# EAGLE schematic PlayaRAMPS1.4 (EAGLE 9.3.1)
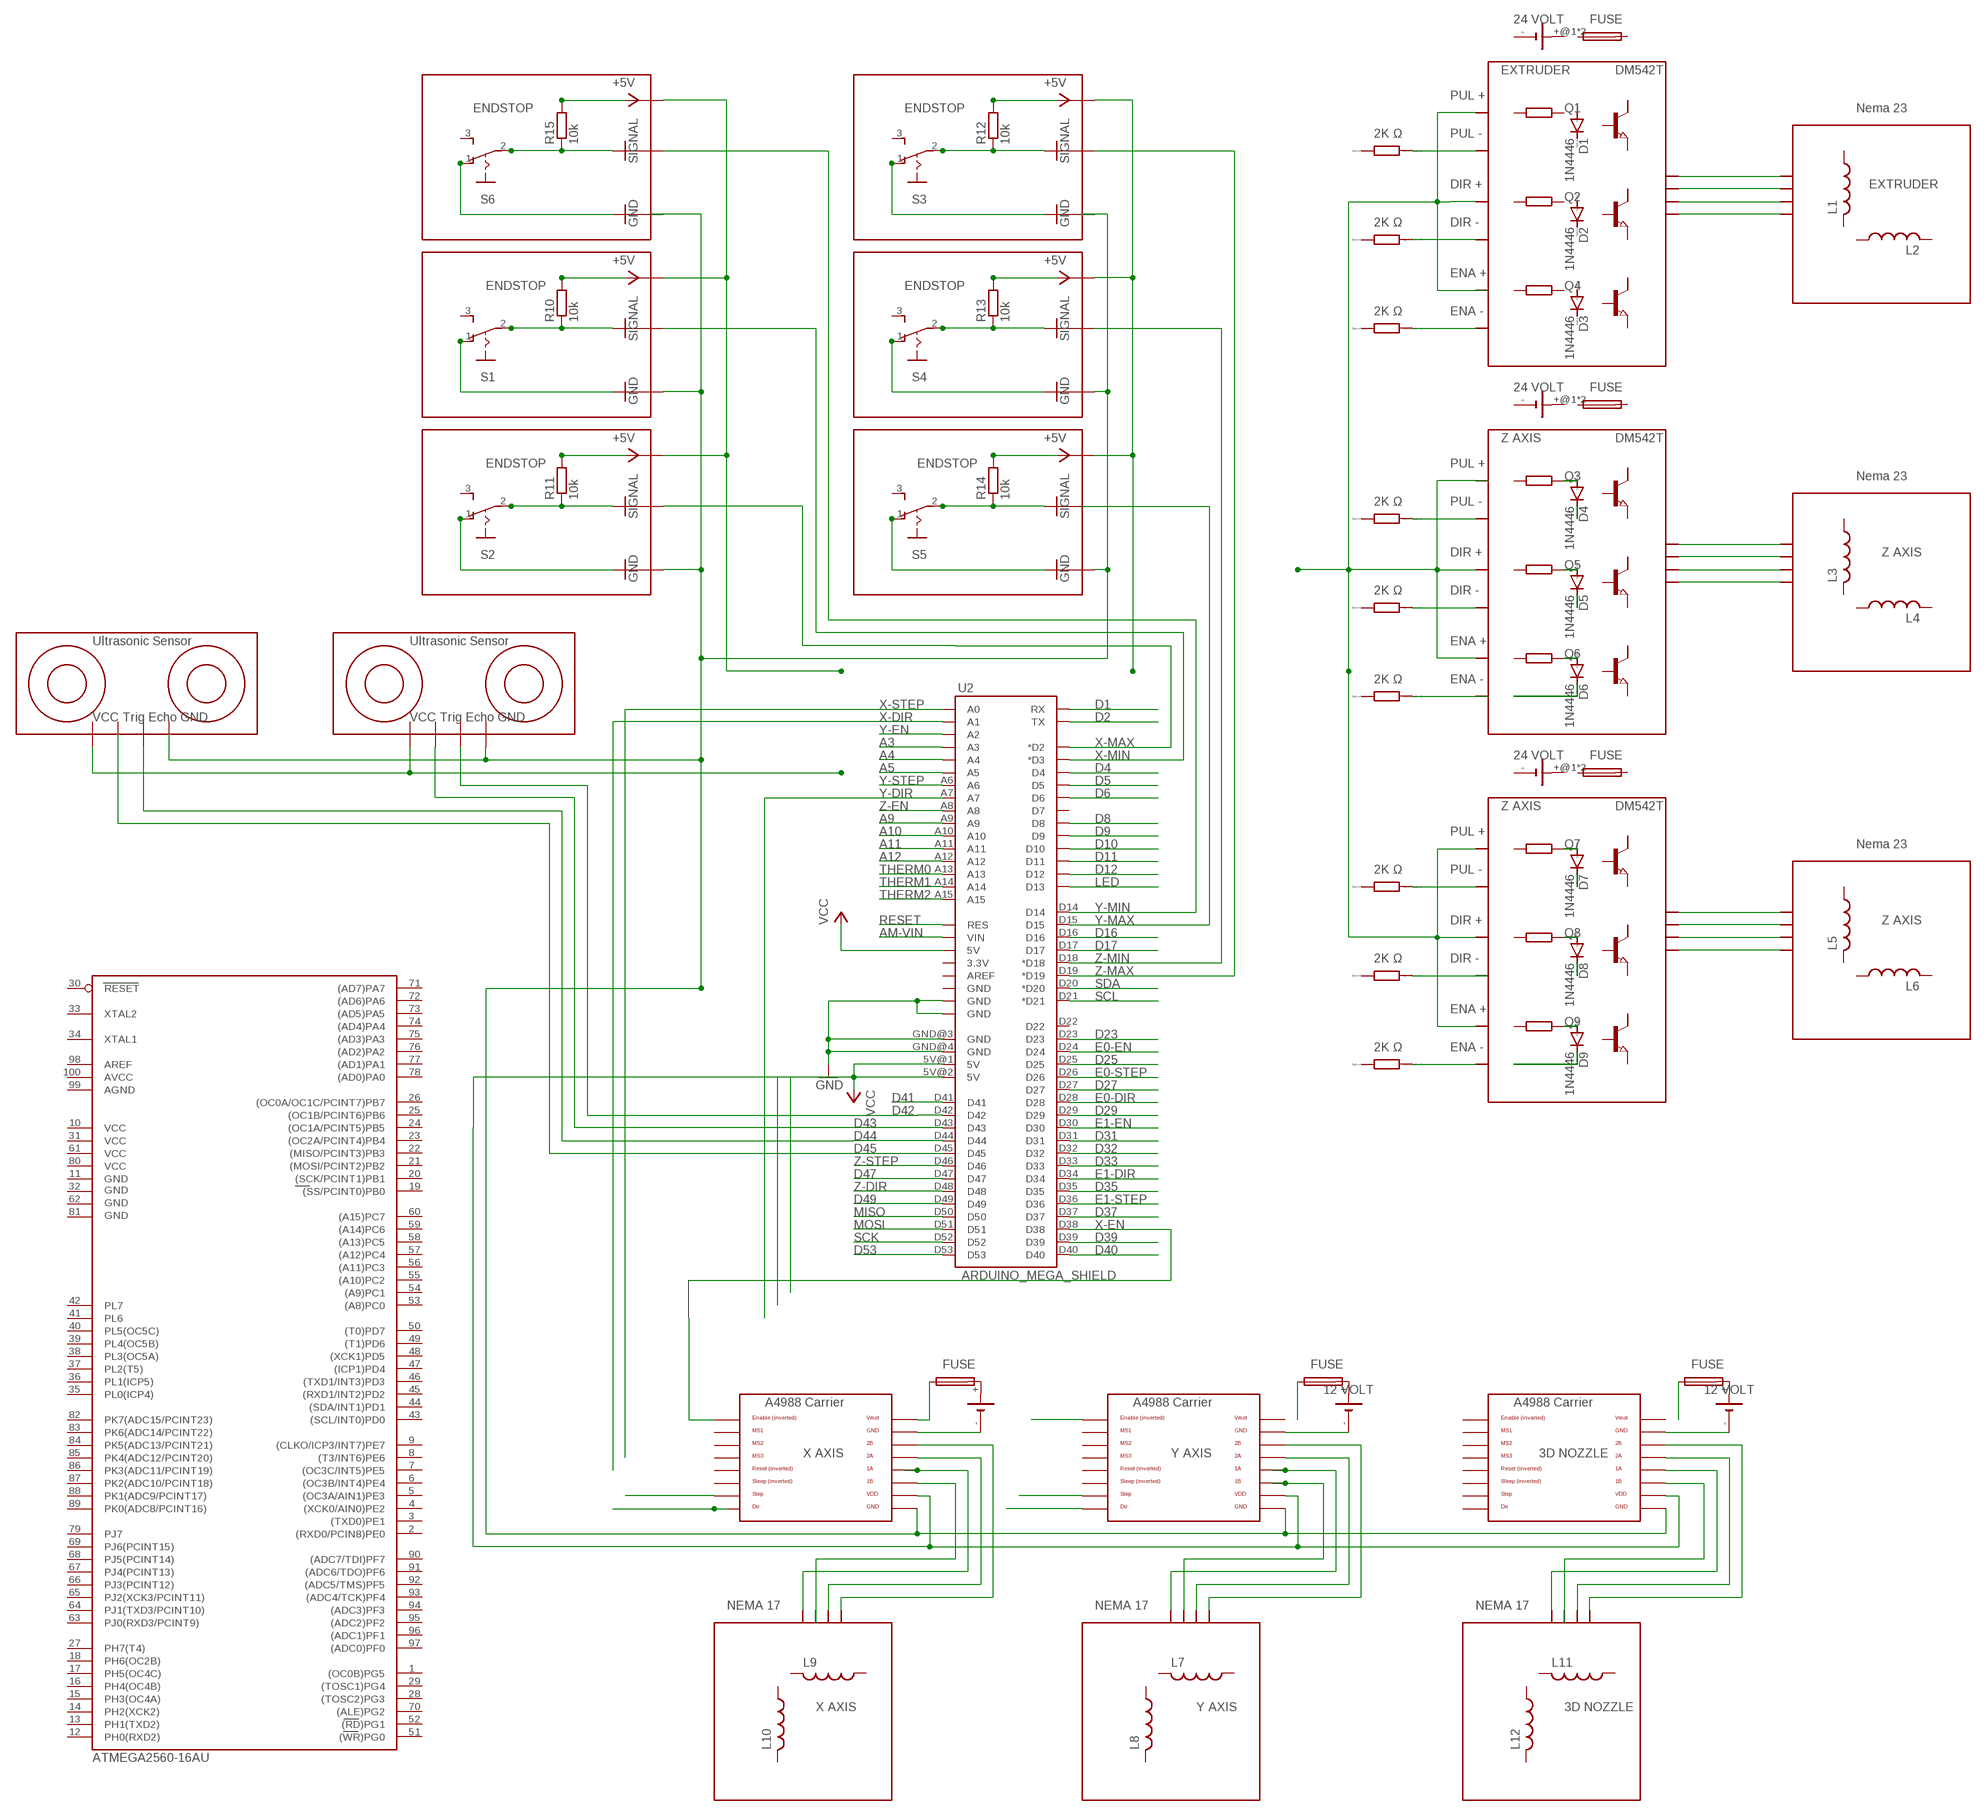
[diagram p0: schematic, sheet 1, part 1 of 2]
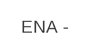
[diagram p1: schematic, sheet 1, part 2 of 2]

## Parts
D1  1N4446  [DO35-10]
D2  1N4446  [DO35-10]
D3  1N4446  [DO35-10]
D4  1N4446  [DO35-10]
D5  1N4446  [DO35-10]
D6  1N4446  [DO35-10]
D7  1N4446  [DO35-10]
D8  1N4446  [DO35-10]
D9  1N4446  [DO35-10]
F1  QPL  [QPL]
F2  QPL  [QPL]
F3  QPL  [QPL]
F4  QPL  [QPL]
F5  QPL  [QPL]
F6  QPL  [QPL]
G1  10MM_SM_COIN_CELL_CLIP  [10MM_SM_COIN_CELL_CLIP]
G2  CH291-1220LF  [CH291-1220LF]
G3  CH291-1220LF  [CH291-1220LF]
G4  CH291-1220LF  [CH291-1220LF]
G5  10MM_SM_COIN_CELL_CLIP  [10MM_SM_COIN_CELL_CLIP]
G6  10MM_SM_COIN_CELL_CLIP  [10MM_SM_COIN_CELL_CLIP]
IC3  ATMEGA2560-16AU  ATMEGA25602560-16AU  [TQFP100]
L1  L-US0204/5  [0204/5]
L2  L-US0204/5  [0204/5]
L3  L-US0204/5  [0204/5]
L4  L-US0204/5  [0204/5]
L5  L-US0204/5  [0204/5]
L6  L-US0204/5  [0204/5]
L7  L-US0204/5  [0204/5]
L8  L-US0204/5  [0204/5]
L9  L-US0204/5  [0204/5]
L10  L-US0204/5  [0204/5]
L11  L-US0204/5  [0204/5]
L12  L-US0204/5  [0204/5]
Q1  NPN-TRANSISTIOR-2COLSOT143  [SOT143]
Q2  NPN-TRANSISTIOR-2COLSOT143  [SOT143]
Q3  NPN-TRANSISTIOR-2COLSOT143  [SOT143]
Q4  NPN-TRANSISTIOR-2COLSOT143  [SOT143]
Q5  NPN-TRANSISTIOR-2COLSOT143  [SOT143]
Q6  NPN-TRANSISTIOR-2COLSOT143  [SOT143]
Q7  NPN-TRANSISTIOR-2COLSOT143  [SOT143]
Q8  NPN-TRANSISTIOR-2COLSOT143  [SOT143]
Q9  NPN-TRANSISTIOR-2COLSOT143  [SOT143]
R10  10k  R-EU_0204/7  [0204/7]
R11  10k  R-EU_0204/7  [0204/7]
R12  10k  R-EU_0204/7  [0204/7]
R13  10k  R-EU_0204/7  [0204/7]
R14  10k  R-EU_0204/7  [0204/7]
R15  10k  R-EU_0204/7  [0204/7]
R16  R  [R0805]
R17  R  [R0805]
R18  R  [R0805]
R19  R  [R0805]
R20  R  [R0805]
R21  R  [R0805]
R22  R  [R0805]
R23  R  [R0805]
R24  R  [R0805]
S1  255SB  [255SB]
S2  255SB  [255SB]
S3  255SB  [255SB]
S4  255SB  [255SB]
S5  255SB  [255SB]
S6  255SB  [255SB]
U2  ARDUINO_MEGA_SHIELD  [ARDUINO_MEGA_SHIELD]
X1  A4988BREAKOUT  [A4988BREAKOUT]
X2  A4988BREAKOUT  [A4988BREAKOUT]
X3  A4988BREAKOUT  [A4988BREAKOUT]

## Nets
+5V: R10.2 R11.2 R12.2 R13.2 R14.2 R15.2
A3: U2.A3
A4: U2.A4
A5: U2.A5
A9: U2.A9
A10: U2.A10
A11: U2.A11
A12: U2.A12
AM-VIN: U2.VIN
D1: U2.RX
D2: U2.TX
D4: U2.D4
D5: U2.D5
D6: U2.D6
D8: U2.D8
D9: U2.D9
D10: U2.D10
D11: U2.D11
D12: U2.D12
D16: U2.D16
D17: U2.D17
D23: U2.D23
D25: U2.D25
D27: U2.D27
D29: U2.D29
D31: U2.D31
D32: U2.D32
D33: U2.D33
D35: U2.D35
D37: U2.D37
D39: U2.D39
D40: U2.D40
D41: U2.D41
D42: U2.D42
D43: U2.D43
D44: U2.D44
D45: U2.D45
D47: U2.D47
D49: U2.D49
D53: U2.D53
E0-DIR: U2.D28
E0-EN: U2.D24
E0-STEP: U2.D26
E1-DIR: U2.D34
E1-EN: U2.D30
E1-STEP: U2.D36
GND: R10.1 R11.1 R12.1 R13.1 R14.1 R15.1 S1.1(O) S1.2(P) S2.1(O) S2.2(P) S3.1(O) S3.2(P) S4.1(O) S4.2(P) S5.1(O) S5.2(P) S6.1(O) S6.2(P) U2.GND@0(GND) U2.GND@1(GND) U2.GND@3(GND) U2.GND@4(GND) ; supply symbol labelled SIGNAL
LED: U2.D13
MISO: U2.D50
MOSI: U2.D51
N$1: D4.A
N$2: R16.2
N$3: R17.2
N$4: X2.STEP
N$5: R18.2
N$6: D5.A
N$7: D6.A
N$8: D6.C
N$9: D5.C
N$10: D4.C
N$15: D7.A
N$16: D8.A
N$17: D9.A
N$18: D9.C
N$19: D8.C
N$20: X2.EN
N$31: F1.2 G2.+
N$32: F2.2 G3.+
N$33: F3.2 G4.+
N$34: X3.1A
N$35: X3.1B
N$37: X3.2A
N$38: X3.2B
N$39: X2.2A
N$40: X1.1B
N$41: X1.1A
N$42: X1.2A
N$43: X1.2B
N$49: D7.C
N$54: R19.2
N$55: R20.2
N$56: R21.2
N$59: R22.2
N$60: R23.2
N$61: R24.2
N$62: X2.1B
N$63: X2.1A
N$64: X2.2B
N$65: G4.- X3.GND
N$66: F3.1
N$67: F2.1
N$68: G3.- X2.GND
N$69: G2.- X1.GND
N$70: F1.1 X1.VMOT
N$72: X1.GND@0(GND) X2.GND@0(GND) X3.GND@0(GND)
RESET: U2.RES
SCK: U2.D52
SCL: U2.D21(*D21)
SDA: U2.D20(*D20)
THERM0: U2.A13
THERM1: U2.A14
THERM2: U2.A15
VCC: U2.5V@0(5V) U2.5V@1(5V) U2.5V@2(5V) X1.VDD X2.VDD X3.VDD
X-DIR: U2.A1
X-DIR1: X1.DIR
X-EN: U2.D38
X-EN1: X1.EN
X-MAX: U2.D2(*D2)
X-MIN: U2.D3(*D3)
X-STEP: U2.A0
X-STEP1: X1.STEP
Y-DIR: U2.A7
Y-DIR1: X2.DIR
Y-EN: U2.A2
Y-MAX: U2.D15
Y-MIN: U2.D14
Y-STEP: U2.A6
Z-DIR: U2.D48
Z-EN: U2.A8
Z-MAX: U2.D19(*D19)
Z-MIN: U2.D18(*D18)
Z-STEP: U2.D46
Unconnected: D1.A D1.C D2.A D2.C D3.A D3.C F4.1 F4.2 F5.1 F5.2 F6.1 F6.2 G1.+@1(+) G1.+@2(+) G1.- G5.+@1(+) G5.+@2(+) G5.- G6.+@1(+) G6.+@2(+) G6.- IC3.1((OC0B)PG5) IC3.2((RXD0/PCIN8)PE0) IC3.3((TXD0)PE1) IC3.4((XCK0/AIN0)PE2) IC3.5((OC3A/AIN1)PE3) IC3.6((OC3B/INT4)PE4) IC3.7((OC3C/INT5)PE5) IC3.8((T3/INT6)PE6) IC3.9((CLKO/ICP3/INT7)PE7) IC3.12(PH0(RXD2)) IC3.13(PH1(TXD2)) IC3.14(PH2(XCK2)) IC3.15(PH3(OC4A)) IC3.16(PH4(OC4B)) IC3.17(PH5(OC4C)) IC3.18(PH6(OC2B)) IC3.19((SS/PCINT0)PB0) IC3.20((SCK/PCINT1)PB1) IC3.21((MOSI/PCINT2)PB2) IC3.22((MISO/PCINT3)PB3) IC3.23((OC2A/PCINT4)PB4) IC3.24((OC1A/PCINT5)PB5) IC3.25((OC1B/PCINT6)PB6) IC3.26((OC0A/OC1C/PCINT7)PB7) IC3.27(PH7(T4)) IC3.28((TOSC2)PG3) IC3.29((TOSC1)PG4) IC3.30(RESET) IC3.33(XTAL2) IC3.34(XTAL1) IC3.35(PL0(ICP4)) IC3.36(PL1(ICP5)) IC3.37(PL2(T5)) IC3.38(PL3(OC5A)) IC3.39(PL4(OC5B)) IC3.40(PL5(OC5C)) IC3.41(PL6) IC3.42(PL7) IC3.43((SCL/INT0)PD0) IC3.44((SDA/INT1)PD1) IC3.45((RXD1/INT2)PD2) IC3.46((TXD1/INT3)PD3) IC3.47((ICP1)PD4) IC3.48((XCK1)PD5) IC3.49((T1)PD6) IC3.50((T0)PD7) IC3.51((WR)PG0) IC3.52((RD)PG1) IC3.53((A8)PC0) IC3.54((A9)PC1) IC3.55((A10)PC2) IC3.56((A11)PC3) IC3.57((A12)PC4) IC3.58((A13)PC5) IC3.59((A14)PC6) IC3.60((A15)PC7) IC3.63(PJ0(RXD3/PCINT9)) IC3.64(PJ1(TXD3/PCINT10)) IC3.65(PJ2(XCK3/PCINT11)) IC3.66(PJ3(PCINT12)) IC3.67(PJ4(PCINT13)) IC3.68(PJ5(PCINT14)) IC3.69(PJ6(PCINT15)) IC3.70((ALE)PG2) IC3.71((AD7)PA7) IC3.72((AD6)PA6) IC3.73((AD5)PA5) IC3.74((AD4)PA4) IC3.75((AD3)PA3) IC3.76((AD2)PA2) IC3.77((AD1)PA1) IC3.78((AD0)PA0) IC3.79(PJ7) IC3.82(PK7(ADC15/PCINT23)) IC3.83(PK6(ADC14/PCINT22)) IC3.84(PK5(ADC13/PCINT21)) IC3.85(PK4(ADC12/PCINT20)) IC3.86(PK3(ADC11/PCINT19)) IC3.87(PK2(ADC10/PCINT18)) IC3.88(PK1(ADC9/PCINT17)) IC3.89(PK0(ADC8/PCINT16)) IC3.90((ADC7/TDI)PF7) IC3.91((ADC6/TDO)PF6) IC3.92((ADC5/TMS)PF5) IC3.93((ADC4/TCK)PF4) IC3.94((ADC3)PF3) IC3.95((ADC2)PF2) IC3.96((ADC1)PF1) IC3.97((ADC0)PF0) IC3.98(AREF) L1.1 L1.2 L2.1 L2.2 L3.1 L3.2 L4.1 L4.2 L5.1 L5.2 L6.1 L6.2 L7.1 L7.2 L8.1 L8.2 L9.1 L9.2 L10.1 L10.2 L11.1 L11.2 L12.1 L12.2 Q1.1(B) Q1.2(C) Q1.3(E) Q1.4(C/) Q2.1(B) Q2.2(C) Q2.3(E) Q2.4(C/) Q3.1(B) Q3.2(C) Q3.3(E) Q3.4(C/) Q4.1(B) Q4.2(C) Q4.3(E) Q4.4(C/) Q5.1(B) Q5.2(C) Q5.3(E) Q5.4(C/) Q6.1(B) Q6.2(C) Q6.3(E) Q6.4(C/) Q7.1(B) Q7.2(C) Q7.3(E) Q7.4(C/) Q8.1(B) Q8.2(C) Q8.3(E) Q8.4(C/) Q9.1(B) Q9.2(C) Q9.3(E) Q9.4(C/) R16.1 R17.1 R18.1 R19.1 R20.1 R21.1 R22.1 R23.1 R24.1 S1.3(S) S2.3(S) S3.3(S) S4.3(S) S5.3(S) S6.3(S) U2.3.3V U2.AREF U2.D7 U2.D22 U2.GND@2(GND) X1.MS1 X1.MS2 X1.MS3 X1.RST X1.SLP(SLEEP) X2.MS1 X2.MS2 X2.MS3 X2.RST X2.SLP(SLEEP) X3.DIR X3.EN X3.MS1 X3.MS2 X3.MS3 X3.RST X3.SLP(SLEEP) X3.STEP

## Notes on the sheet
- 24 VOLT | FUSE
- GND | GND | VCC
- EXTRUDER | DM542T
- PUL + | 270Ω
- ENDSTOP | ENDSTOP | Nema 23
- 2K Ω | PUL -
- A+ | A+
- DIR + | 270Ω | A- | A- | EXTRUDER
- B+ | B+
- B- | B-
- 2K Ω | DIR -
- ENA + | 270Ω
- ENDSTOP | ENDSTOP
- 2K Ω | ENA -
- 24 VOLT | FUSE
- GND | VCC
- Z AXIS | DM542T
- ENDSTOP | ENDSTOP | PUL + | 270Ω
- Nema 23
- 2K Ω | PUL -
- A+ | A+
- DIR + | 270Ω | A- | A- | Z AXIS
- B+ | B+
- B- | B-
- 2K Ω | DIR -
- Ultrasonic Sensor | Ultrasonic Sensor | ENA + | 270Ω
- 2K Ω | ENA -
- VCC Trig Echo GND | VCC Trig Echo GND
- 24 VOLT | FUSE
- GND | VCC
- Z AXIS | DM542T
- PUL + | 270Ω
- Nema 23
- 2K Ω | PUL -
- A+ | A+
- DIR + | 270Ω | A- | A- | Z AXIS
- B+ | B+
- B- | B-
- 2K Ω | DIR -
- ENA + | 270Ω
- 2K Ω | ENA -
- FUSE | FUSE | FUSE
- 12 VOLT | 12 VOLT
- X AXIS | Y AXIS | 3D NOZZLE
- NEMA 17 | 1A 1B 2A 2B | NEMA 17 | 1A 1B 2A 2B | NEMA 17 | 1A 1B 2A 2B
- X AXIS | Y AXIS | 3D NOZZLE
- 2B = Black
  2A = Green
  1A = Red
  1B = Blue
- 2B = Black
  2A = Green
  1A = Red
  1B = Blue
- 2B = Black
  2A = Green
  1A = Red
  1B = Blue
- ENA -

## Power pins joined to a net without a drawn wire
AGND: IC3.99(AGND)
AVCC: IC3.100(AVCC)
GND: IC3.11(GND)
GND1: IC3.32(GND1)
GND2: IC3.62(GND2)
GND3: IC3.81(GND3)
VCC: IC3.10(VCC)
VCC1: IC3.31(VCC1)
VCC2: IC3.61(VCC2)
VCC3: IC3.80(VCC3)
VMOT: X2.VMOT X3.VMOT

## Library data of the parts
D1-D9 = diode:1N4446: DIODE high speed (Philips)
F1-F6 = fuse:QPL: Fuseholder for Micro(TM) Fuse or Pico(R) II Fuses 281 005, 281 008 Source:www.littlefuse.com .. 281005A.PDF; OC_FARNELL: 1608231; OC_NEWARK: unknown
G1 G5 G6 = battery:10MM_SM_COIN_CELL_CLIP: Battery cell clip for CR927 Source: KEYSTONE ELECTRONICS CORP. www.keyelco.com, ASTORIA, N.Y. 11105-2017 PART ANME 10mm SM COIN CELl CLIP DWG NO. 3030
G2-G4 = battery:CH291-1220LF: Battery Holder, SMT, 12mm multicomp PART NO. CH291-1220LF Source: Data sheet <http://www.farnell.com/datasheets/1505860.pdf>
IC3 = SmartPrj:ATMEGA2560: MICROCONTROLLER 64/128/256 Kbytes FLASH 4 Kbytes EEPROM 8 Kbytes SRAM 86 General Purpose I/O pins 12-channels16-bit PWM 4 x Serial USARTs 16-channels 10-bit A/D
L1-L12 = rcl:L-US: INDUCTOR, American symbol; SPICEPREFIX: L
Q1-Q9 = semicon-smd-ipc:NPN-TRANSISTIOR-2COL: NPN TRANSISTOR 2 colletor pins
R10-R15 = resistor:R-EU_: RESISTOR, European symbol
R16-R24 = eagle-ltspice:R: RESISTOR, European symbol; SPICEMODEL: NONE; SPICEPREFIX: R
S1-S6 = switch:255SB: SLIDING SWITCH Distributor Buerklin, 11G810
U2 = RepRapjr:ARDUINO_MEGA_SHIELD
X1-X3 = RepRapjr:A4988BREAKOUT

## Net classes
1 power: width 0.61 mm, drill 0.406 mm, clearance 0.203 mm
2 gnd: width 0.305 mm, drill 0.406 mm, clearance 0.203 mm
3 power usb: width 0.508 mm, drill 0.406 mm, clearance 0.203 mm